# EAGLE design musshca_charles_tp4_2019 (EAGLE 9.5.2)
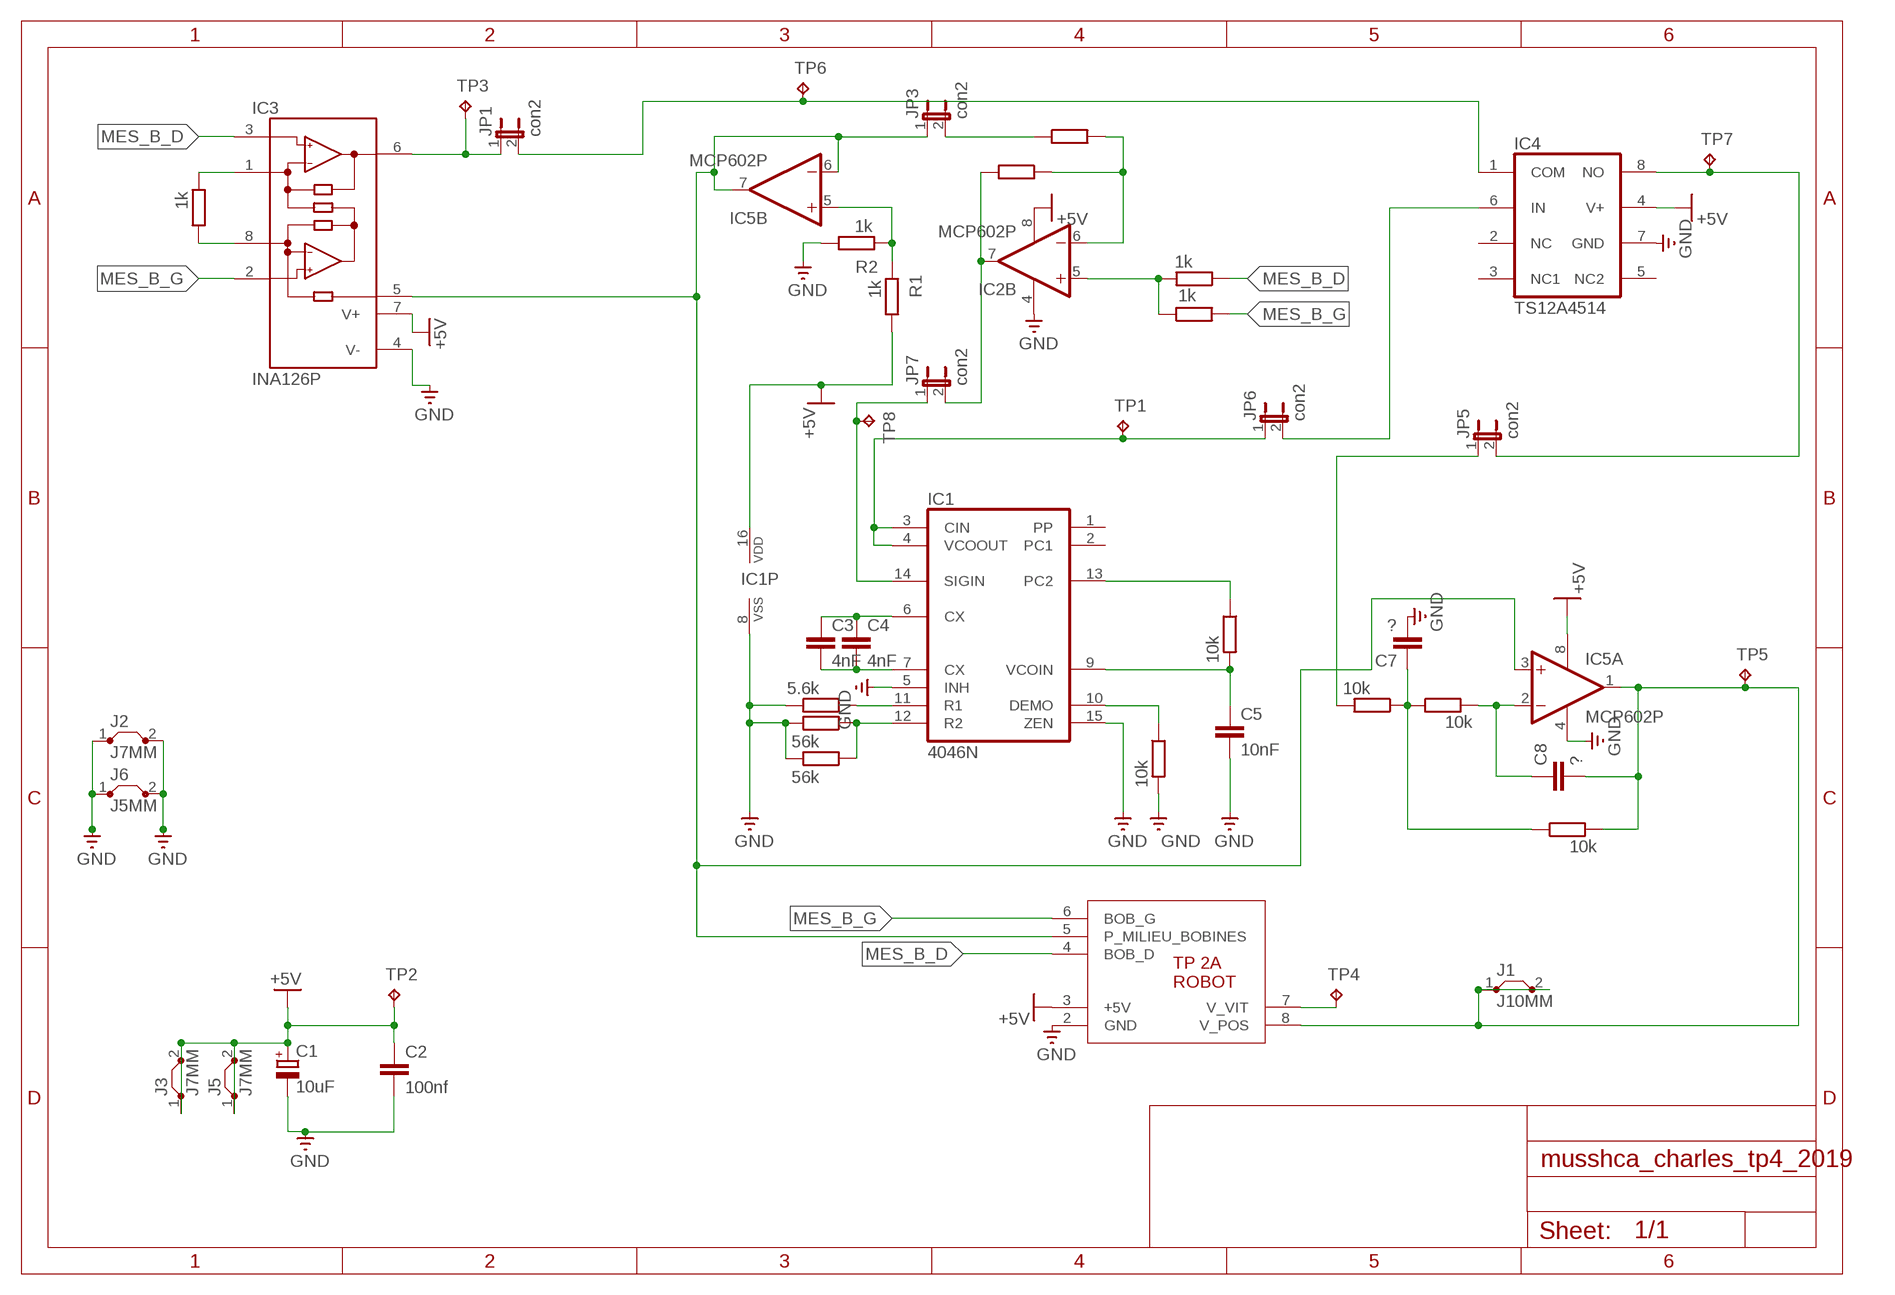
[diagram p0: schematic, sheet 1]

## Parts
C1  10uF  CPOL-EUE2.5-7  [E2,5-7]
C2  100nf  C-EU050-030X075  [C050-030X075]
C3  4nF  C-EU050-030X075  [C050-030X075]
C4  4nF  C-EU050-030X075  [C050-030X075]
C5  10nF  C-EU050-030X075  [C050-030X075]
C7  ?  C-EU050-030X075  [C050-030X075]
C8  ?  C-EU050-030X075  [C050-030X075]
IC1  4046N  [DIL16]
IC2  MCP602P  [DIL08]
IC3  INA126P  [DIL08]
IC4  TS12A4514  [DIL08]
IC5  MCP602P  [DIL08]
J1  J10MM  [10]
J2  J7MM  [07]
J3  J7MM  [07]
J5  J7MM  [07]
J6  J5MM  [05]
JP1  con2  JP1E  [JP1]
JP3  con2  JP1E  [JP1]
JP5  con2  JP1E  [JP1]
JP6  con2  JP1E  [JP1]
JP7  con2  JP1E  [JP1]
R1  1k  R-EURC07  [RC07]
R2  1k  R-EURC07  [RC07]
R3  1k  R-EURC07  [RC07]
R4  1k  R-EURC07  [RC07]
R5  5.6k  R-EURC07  [RC07]
R6  1k  R-EURC07  [RC07]
R7  1k  R-EURC07  [RC07]
R8  56k  R-EURC07  [RC07]
R9  56k  R-EURC07  [RC07]
R10  10k  R-EURC07  [RC07]
R11  10k  R-EURC07  [RC07]
R12  10k  R-EURC07  [RC07]
R13  10k  R-EURC07  [RC07]
R14  10k  R-EURC07  [RC07]
RG  1k  R-EURC07  [RC07]
TP1  TPPAD1-13  [P1-13]
TP2  TPPAD1-13  [P1-13]
TP3  TPPAD1-13  [P1-13]
TP4  TPPAD1-13  [P1-13]
TP5  TPPAD1-13  [P1-13]
TP6  TPPAD1-13  [P1-13]
TP7  TPPAD1-13  [P1-13]
TP8  TPPAD1-13  [P1-13]
U$1  TP2A_ROBOT  [TP2A_ROBOT]

## Nets
+5V: C1.+ C2.1 IC1.16(VDD) IC2.8(P:V+) IC3.7(V+) IC4.4(V+) IC5.8(P:V+) J3.1 J3.2 J5.1 J5.2 R1.P$2 TP2.TP U$1.3(+5V)
GND: C1.- C2.2 C5.2 C7.2 IC1.5(INH) IC1.8(VSS) IC1.15(ZEN) IC2.4(P:V-) IC3.4(V-) IC4.7(GND) IC5.4(P:V-) J2.1 J2.2 J6.1 J6.2 R2.P$2 R5.P$2 R8.P$2 R9.P$2 R11.P$2 U$1.2(GND)
MES_B_D: IC3.3(+IN) R3.P$1 U$1.4(BOB_D)
MES_B_G: IC3.2(-IN) R4.P$2 U$1.6(BOB_G)
N$1: JP5.1 R13.P$2
N$2: IC3.6(OUT) JP1.1 TP3.TP
N$3: TP4.TP U$1.7(V_VIT)
N$4: IC3.8(RG) RG.P$2
N$9: IC3.1(RG) RG.P$1
N$10: IC5.5(B:+IN) R1.P$1 R2.P$1
N$11: IC3.5(REF) IC5.3(A:+IN) IC5.6(B:-IN) IC5.7(B:OUT) JP3.1 U$1.5(P_MILIEU_BOBINES)
N$12: C8.2 IC5.1(A:OUT) J1.1 J1.2 R14.P$2 TP5.TP U$1.8(V_POS)
N$13: IC4.1(COM) JP1.2 TP6.TP
N$14: IC2.5(B:+IN) R3.P$2 R4.P$1
N$15: IC4.8(NO) JP5.2 TP7.TP
N$16: IC2.7(B:OUT) JP7.2 R6.P$2
N$17: IC2.6(B:-IN) R6.P$1 R7.P$2
N$19: IC1.11(R1) R5.P$1
N$20: C7.1 R12.P$1 R13.P$1 R14.P$1
N$21: IC1.12(R2) R8.P$1 R9.P$1
N$22: C3.1 C4.1 IC1.6(CX)
N$23: C3.2 C4.2 IC1.7(CX)
N$24: IC4.6(IN) JP6.2
N$25: IC1.10(DEMO) R11.P$1
N$26: IC1.13(PC2) R10.P$1
N$27: C5.1 IC1.9(VCOIN) R10.P$2
N$29: JP3.2 R7.P$1
N$30: C8.1 IC5.2(A:-IN) R12.P$2
N$34: IC1.3(CIN) IC1.4(VCOOUT) JP6.1 TP1.TP
N$35: IC1.14(SIGIN) JP7.1 TP8.TP
Unconnected: IC1.1(PP) IC1.2(PC1) IC2.1(A:OUT) IC2.2(A:-IN) IC2.3(A:+IN) IC4.2(NC) IC4.3(NC1) IC4.5(NC2)

## Library data of the parts
C1 = resistor:CPOL-EU: POLARIZED CAPACITOR, European symbol
C2-C5 C7 C8 = rcl:C-EU: CAPACITOR, European symbol
IC1 = 40xx:4046: Micropower PLL
IC2 IC5 = linear:MCP602: Single Op Amp 2.7V to 6.0V Single Supply CMOS Source: http://ww1.microchip.com/downloads/en/DeviceDoc/21314g.pdf
IC3 = burr-brown:INA126: Instrumentation Amplifier Micropower, Single and Dual Versions; MF: TEXAS INSTRUMENT CONNECTORS; MPN: INA126P; OC_FARNELL: 1509595; OC_NEWARK: 74C9780
IC4 = Clouard:TS12A4514: ANALOG SWITCH Commutateur SPST analogique, Simple NO, 3 V, 5 V, 9 V, PDIP, 8 broches; MPN: TS12A4514PE4; OC_NEWARK: 77C9073; RS: 459-613
J1-J3 J5 J6 = jumper:J: Bridge
JP1 JP3 JP5-JP7 = jumper:JP1E: JUMPER
R1-R14 RG = Clouard:R-EU: RESISTOR ensi, European symbol
TP1-TP8 = testpad:TP: Test pad
U$1 = Clouard:TP2A_ROBOT

## Net classes
0 default: width 0.381 mm, drill 0.762 mm, clearance 0.381 mm

## Board
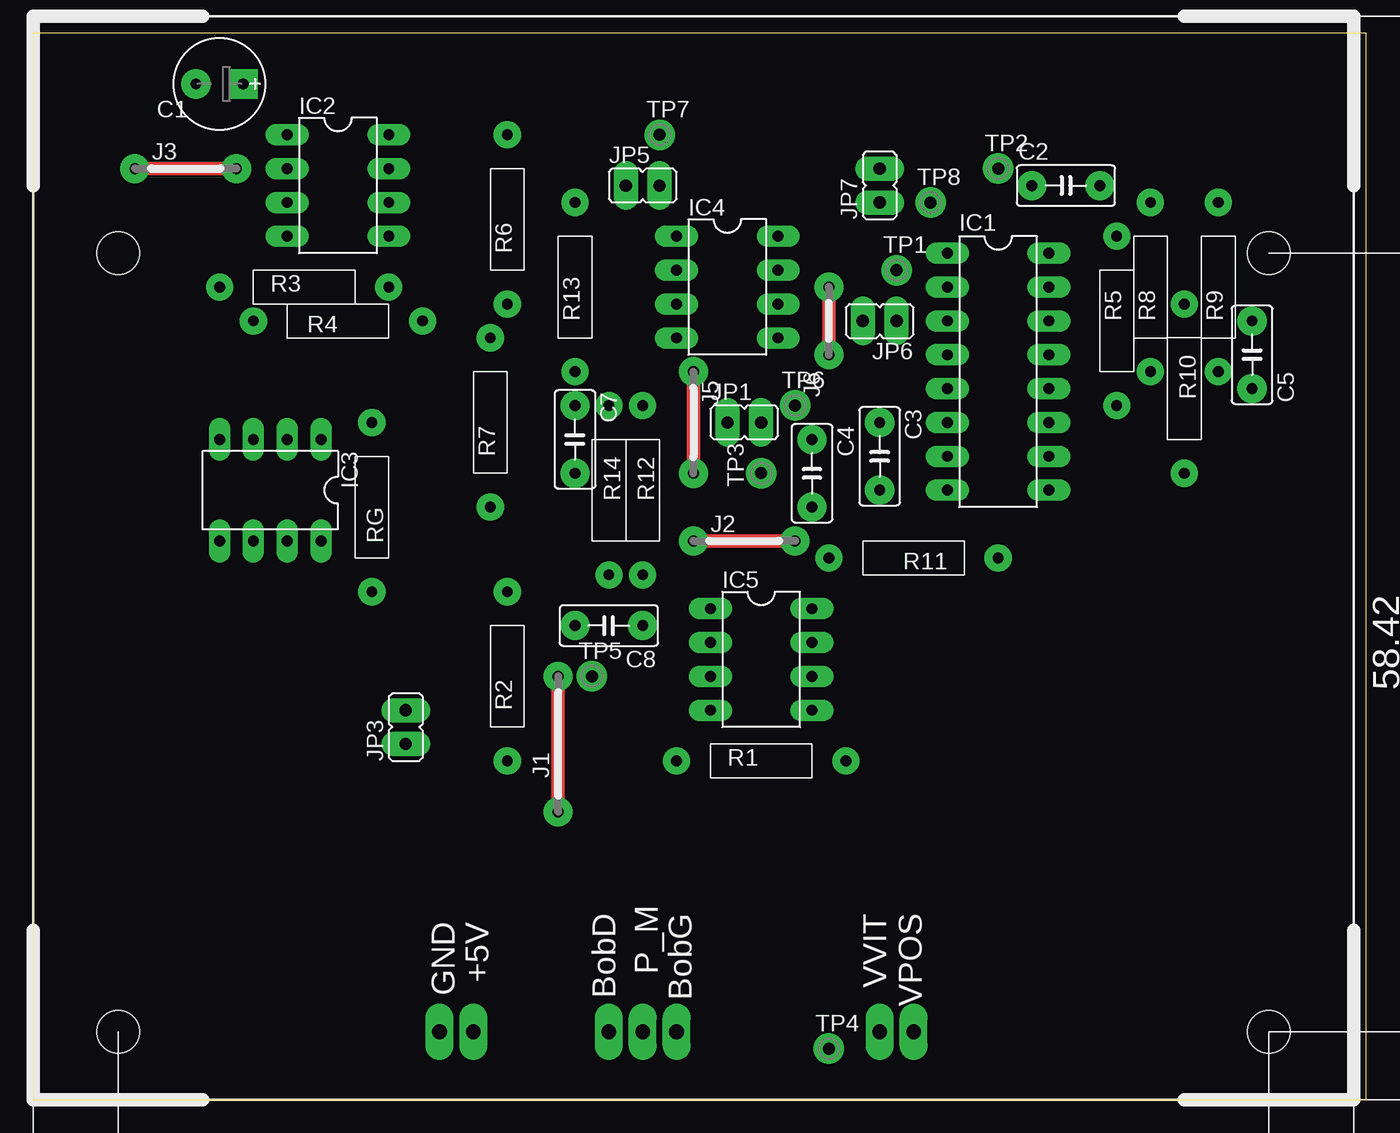
[diagram p1: board, top side]
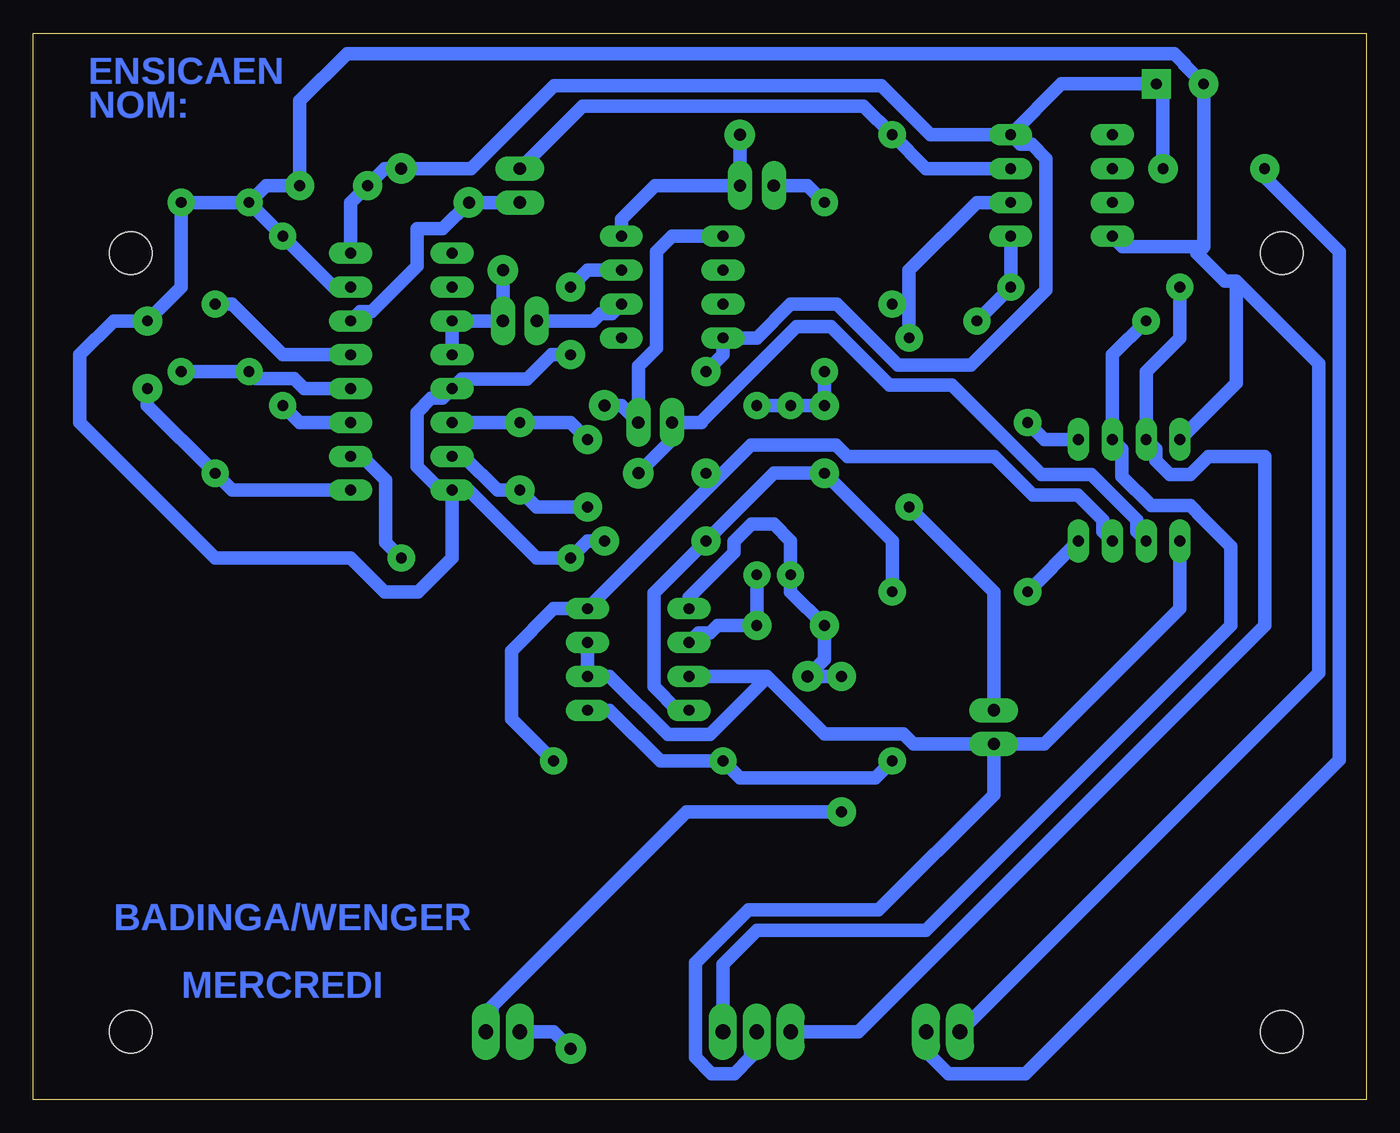
[diagram p2: board, bottom side, seen from below]

Size 100 x 80 mm. Coordinates in mm from the lower left corner, seen from the top.
Outline: 0,0 100,0 100,80 0,80 0,0
Copper layers (1*16): Top 0.035mm / dielectric 1.5mm / Bottom 0.035mm
Design rules "default": minimum track width 40mil, minimum drill 0.8mm, track to track 20mil, track to pad 20mil, pad to pad 20mil, via to via 20mil, smd to smd 8mil, copper to edge 40mil, drill to drill 8mil, minimum pad ring 10mil, minimum via ring 8mil, stop-mask expansion 4mil, vias tented up to drill 0mil, thermal gap 10mil

### Footprints (pad centres in the part's own frame; a part is rotated, then mirrored left to right if it is on the bottom)
E2,5-7 = drill 0.813 pad 2.184 square: + -1.77,0 | drill 0.813 pad 2.184: - 1.77,0
C050-030X075 = drill 0.813 pad 2.184: 1 -2.54,0; 2 2.54,0
DIL16 = drill 0.813 long: 1 -8.89,-3.81; 2 -6.35,-3.81; 3 -3.81,-3.81; 4 -1.27,-3.81; 5 1.27,-3.81; 6 3.81,-3.81; 7 6.35,-3.81; 8 8.89,-3.81; 9 8.89,3.81; 10 6.35,3.81; 11 3.81,3.81; 12 1.27,3.81; 13 -1.27,3.81; 14 -3.81,3.81; 15 -6.35,3.81; 16 -8.89,3.81
DIL08 = drill 0.813 long: 1 -3.81,-3.81; 2 -1.27,-3.81; 3 1.27,-3.81; 4 3.81,-3.81; 5 3.81,3.81; 6 1.27,3.81; 7 -1.27,3.81; 8 -3.81,3.81
10 = drill 0.813 pad 2.184: 1 -5.08,0; 2 5.08,0
07 = drill 0.813 pad 2.184: 1 -3.81,0; 2 3.81,0
05 = drill 0.813 pad 2.184: 1 -2.54,0; 2 2.54,0
JP1 = drill 0.914 long: 1 0,-1.27; 2 0,1.27
RC07 = drill 0.813 pad 2.032: P$1 -6.35,0; P$2 6.35,0
P1-13 = drill 0.9 pad 2.286: TP 0,0
TP2A_ROBOT = drill 1.1 pad 1.676 long: 2 30.48,5.08; 3 33.02,5.08; 4 43.18,5.08; 5 45.72,5.08; 6 48.26,5.08; 7 63.5,5.08; 8 66.04,5.08 | hole 3.2: 6.35,63.5; 92.71,63.5; 92.71,5.08; 6.35,5.08

### Placement (x,y rotation side)
C1  13.97,76.2 180 top
C2  77.47,68.58 0 top
C3  63.5,48.26 270 top
C4  58.42,46.99 270 top
C5  91.44,55.88 90 top
C7  40.64,49.53 270 top
C8  43.18,35.56 180 top
IC1  72.39,54.61 270 top
IC2  22.86,68.58 270 top
IC3  17.78,45.72 180 top
IC4  52.07,60.96 270 top
IC5  54.61,33.02 270 top
J1  39.37,26.67 90 top
J2  53.34,41.91 0 top
J3  11.43,69.85 0 top
J5  49.53,50.8 270 top
J6  59.69,58.42 90 top
JP1  53.34,50.8 270 top
JP3  27.94,27.94 0 top
JP5  45.72,68.58 270 top
JP6  63.5,58.42 90 top
JP7  63.5,68.58 0 top
R1  54.61,25.4 0 top
R2  35.56,31.75 90 top
R3  20.32,60.96 0 top
R4  22.86,58.42 180 top
R5  81.28,58.42 90 top
R6  35.56,66.04 90 top
R7  34.29,50.8 90 top
R8  83.82,60.96 90 top
R9  88.9,60.96 90 top
R10  86.36,53.34 270 top
R11  66.04,40.64 180 top
R12  45.72,45.72 270 top
R13  40.64,60.96 90 top
R14  43.18,45.72 270 top
RG  25.4,44.45 270 top
TP1  64.77,62.23 0 top
TP2  72.39,69.85 0 top
TP3  54.61,46.99 90 top
TP4  59.69,3.81 0 top
TP5  41.91,31.75 0 top
TP6  57.15,52.07 0 top
TP7  46.99,72.39 0 top
TP8  67.31,67.31 0 top
U$1  0,0 0 top

### Tracks (layer width: path | path; a pad name or v marks a point on that pad's centre or on a via)
+5V
  Top 1.016: J3.1 J3.2 | J5.1 J5.2
  Bottom 1.016: IC1.16 76.2,67.31 C2.1 73.66,69.85 TP2.TP 67.14,69.85 60.92,76.07 36.37,76.07 32.69,72.39 IC2.8 | IC2.8 22.86,76.2 C1.+ 15.24,75.7 J3.2 | IC2.8 25.96,71.68 25.1,71.68 24.03,70.61 24.03,60.73 29.64,55.12 35.13,55.12 39.7,59.69 43.18,59.69 45.72,57.15 IC4.4 48.26,55.88 J5.1 | IC3.7 19.76,42.62 19.76,43.48 21.64,45.36 24.99,45.36 27.89,48.26 38.93,48.26 39.77,49.1 46.15,49.1 48.9,46.35 | 48.9,46.35 IC5.8 60.96,36.83 64.14,33.66 64.14,28.57 R1.P$2 | U$1.3 33.02,3.63 31.34,1.95 25.55,1.95 2.03,25.47 2.03,63.6 7.62,69.19 J3.1 | J5.2 48.9,46.35
GND
  Top 1.016: J6.2 J6.1 | J2.1 J2.2
  Bottom 1.016: R8.P$2 R9.P$2 88.9,60.96 C5.2 93.98,58.42 96.52,55.88 96.52,50.8 86.36,40.64 76.2,40.64 73.66,38.1 71.12,38.1 68.58,40.64 IC1.8 | R8.P$2 82.55,68.58 C2.2 80.01,74.93 76.46,78.48 14.39,78.48 13.63,77.71 13.63,77.63 C1.- 12.2,64 | R8.P$2 R5.P$2 77.47,60.96 IC1.15 | IC1.8 67.34,45.72 62.26,40.64 R11.P$2 58.42,41.91 J2.2 | IC1.8 69.44,45.72 71.22,47.5 71.22,51.56 70.15,52.63 69.29,52.63 IC1.5 67.87,54.05 62.95,54.05 61.13,55.88 J6.1 | R2.P$2 35.56,41.91 C7.2 44.45,46.99 J2.1 53.44,38 53.44,30.99 51.66,29.21 IC5.4 | U$1.2 3.56,32 3.56,55.22 9.73,61.39 | IC4.7 58.42,62.23 J6.2 | IC3.4 9.73,53.77 9.73,61.39 | 12.2,64 12.7,63.5 10.59,61.39 9.73,61.39 | 12.2,64 18.28,64 IC2.4
MES_B_D
  Bottom 1.016: R3.P$1 13.97,57.15 16.51,54.61 IC3.3 15.8,48.82 15.8,47.96 14.73,46.89 13.21,46.89 11.84,48.26 7.62,48.26 7.62,35.56 38.1,5.08 U$1.4
MES_B_G
  Bottom 1.016: R4.P$2 19.05,55.88 IC3.2 18.34,48.82 18.34,46.75 16.14,44.55 13.21,44.55 12.27,43.61 12.14,43.48 10.16,41.5 10.16,35.56 33.02,12.7 45.72,12.7 48.26,10.16 U$1.6
N$1
  Bottom 1.016: R13.P$2 41.91,68.58 JP5.1
N$2
  Bottom 1.016: TP3.TP 52.07,49.53 JP1.1 49.86,50.8 49.86,50.85 42.74,57.98 40.15,57.98 35.76,53.59 31.07,53.59 24.36,46.89 20.63,46.89 17.22,43.48 17.22,42.62 IC3.6
N$3
  Bottom 1.016: TP4.TP 60.96,5.08 U$1.7
N$4
  Bottom 1.016: IC3.8 RG.P$2
N$9
  Bottom 1.016: RG.P$1 24.13,49.53 IC3.1
N$10
  Bottom 1.016: R2.P$1 36.83,24.13 46.99,24.13 R1.P$1 52.95,25.4 56.77,29.21 IC5.5
N$11
  Bottom 1.016: IC5.3 44.96,31.75 44.91,31.7 | IC5.7 IC5.6 56.77,31.75 52.4,27.38 49.23,27.38 44.91,31.7 | U$1.5 46.19,4.61 46.19,3.16 47.4,1.95 49.12,1.95 50.33,3.16 50.33,10.24 46.35,14.22 36.58,14.22 27.94,22.86 JP3.1 | JP3.1 24.13,26.67 13.97,36.83 IC3.5 | JP3.1 33.96,26.67 34.72,27.43 40.65,27.43 44.91,31.7
N$12
  Top 1.016: J1.2 J1.1
  Bottom 1.016: U$1.8 65.57,5.55 65.57,7 50.98,21.59 J1.1 | J1.2 TP5.TP 40.64,33.02 C8.2 43.18,38.1 R14.P$2 43.18,41.91 44.45,43.18 45.72,43.18 46.1,43.18 47.42,41.86 47.42,41.04 50.8,37.66 IC5.1
N$13
  Bottom 1.016: IC4.1 52.07,64.77 53.24,63.6 53.24,56.39 54.61,55.02 JP1.2 55.88,52.07 TP6.TP
N$14
  Bottom 1.016: IC2.5 R3.P$2 R4.P$1
N$15
  Bottom 1.016: IC4.8 55.88,66.04 53.34,68.58 JP5.2 TP7.TP
N$16
  Bottom 1.016: JP7.2 58.8,74.55 37.72,74.55 R6.P$2 33.02,69.85 IC2.7
N$17
  Bottom 1.016: IC2.6 29.21,67.31 34.29,62.23 34.29,59.69 | 34.29,59.69 R6.P$1 | 34.29,59.69 R7.P$2
N$19
  Bottom 1.016: R5.P$1 80.01,50.8 IC1.11
N$20
  Bottom 1.016: R13.P$1 C7.1 R14.P$1 R12.P$1
N$21
  Bottom 1.016: R9.P$1 R8.P$1 83.31,54.1 80.44,54.1 79.68,53.34 IC1.12
N$22
  Bottom 1.016: C4.1 59.69,50.8 C3.1 IC1.6
N$23
  Bottom 1.016: IC1.7 67.72,48.26 65.18,45.72 C3.2 62.23,44.45 C4.2
N$24
  Bottom 1.016: IC4.6 56.59,58.98 57.45,58.98 58.01,58.42 JP6.2
N$25
  Bottom 1.016: IC1.10 75.34,48.26 73.56,46.48 73.56,41.81 R11.P$1
N$26
  Bottom 1.016: IC1.13 81.28,55.88 85.09,59.69 R10.P$1
N$27
  Bottom 1.016: C5.1 91.44,52.07 R10.P$2 85.09,45.72 IC1.9
N$29
  Bottom 1.016: JP3.2 27.94,38.1 R7.P$1
N$30
  Bottom 1.016: R12.P$2 C8.1 48.67,35.56 49.23,35 50.09,35 IC5.2
N$34
  Bottom 1.016: TP1.TP JP6.1 IC1.3 IC1.4
N$35
  Bottom 1.016: IC1.14 75.49,59.13 74.63,59.13 71.22,62.54 71.22,65.33 69.29,65.33 TP8.TP JP7.1

### Text on the board
Bottom: BADINGA/WENGER | MERCREDI